# Altium project osuBoard.PrjPcb
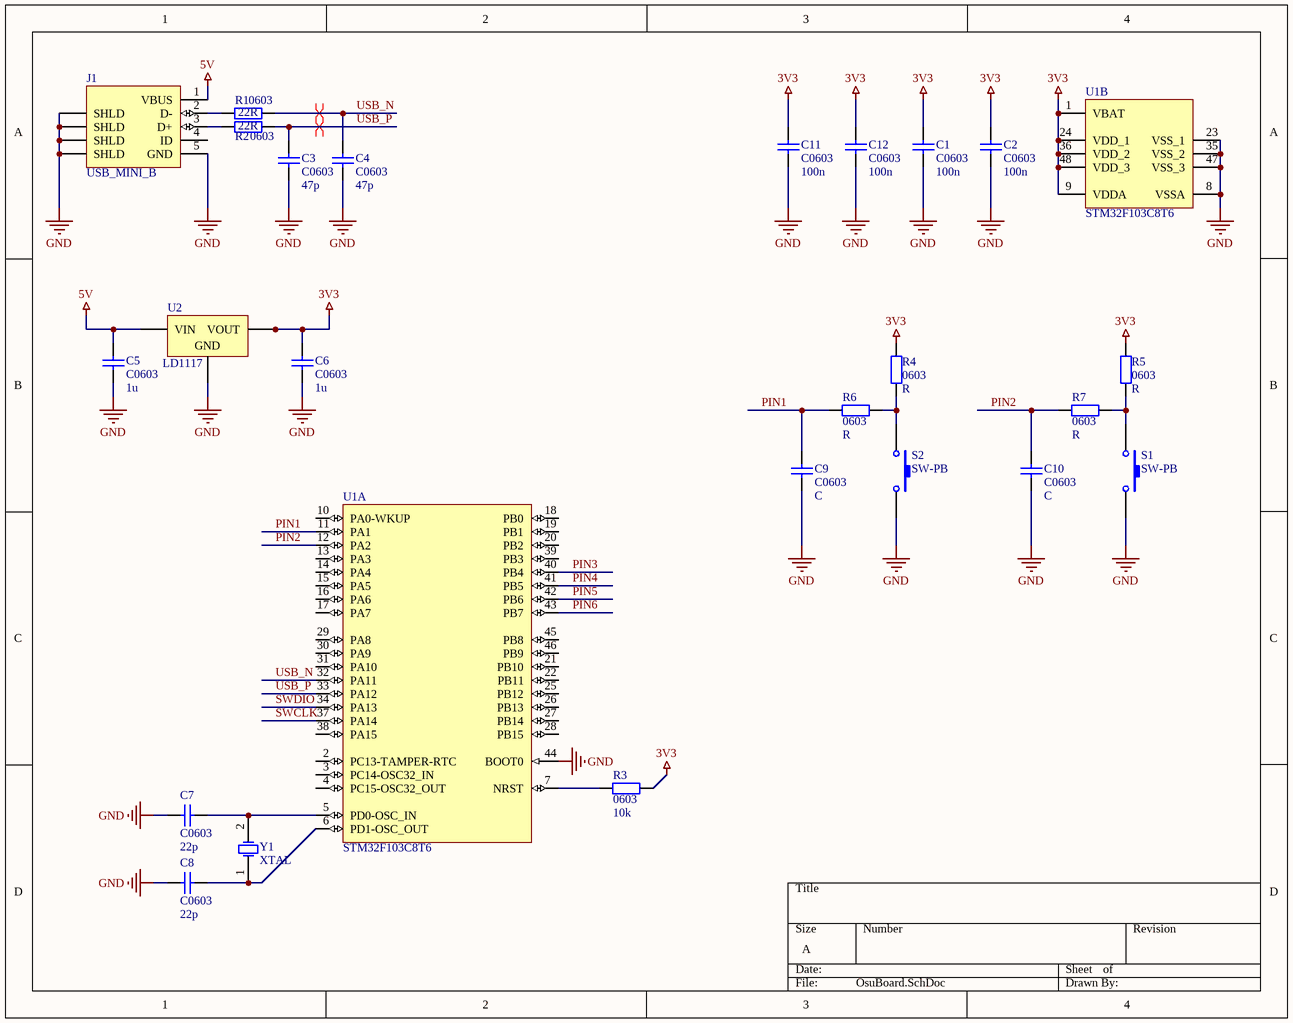
[diagram p0: OsuBoard.SchDoc]
1 sheet, 25 parts. Net scope: global (net labels, ports and power ports of the same name join across sheets).
Board file: OsuBoard.PcbDoc

## Sheet OsuBoard.SchDoc
size A

### Parts
C1  100n  [C0603]
C2  100n  [C0603]
C3  47p  [C0603]
C4  47p  [C0603]
C5  1u  [C0603]
C6  1u  [C0603]
C7  22p  [C0603]
C8  22p  [C0603]
C9  C  [C0603]
C10  C  [C0603]
C11  100n  [C0603]
C12  100n  [C0603]
J1  USB_MINI_B  [USB_Mini_B_9.3x7.7]
R1  22R  [0603]
R2  22R  [0603]
R3  10k  [0603]
R4  R  [0603]
R5  R  [0603]
R6  R  [0603]
R7  R  [0603]
S1  SW-PB  [Cherry MX footprint]
S2  SW-PB  [Cherry MX footprint]
U1  STM32F103C8T6  [QFP_48_0.5_M]  (parts A,B of 2)
U2  LD1117  [TO-252]
Y1  XTAL  [HC49]

### Nets
3V3: C1.1 C2.1 C6.1 C11.1 C12.1 R3.2 R4.1 R5.1 U1.1(VBAT) U1.9(VDDA) U1.24(VDD_1) U1.36(VDD_2) U1.48(VDD_3) U2.2(VOUT) U2.4(VOUT) U2.5(VOUT) U2.6(VOUT)
5V: C5.1 J1.1(VBUS) U2.3(VIN)
GND: C1.2 C2.2 C3.2 C4.2 C5.2 C6.2 C7.1 C8.1 C9.2 C10.2 C11.2 C12.2 J1.5(GND) J1.MH1(SHLD) J1.MH2(SHLD) J1.MH3(SHLD) J1.MH4(SHLD) S1.2 S2.2 U1.8(VSSA) U1.23(VSS_1) U1.35(VSS_2) U1.44(BOOT0) U1.47(VSS_3) U2.1(GND)
PIN1: C9.1 R6.1 U1.11(PA1)
PIN2: C10.1 R7.1 U1.12(PA2)
PIN3: U1.40(PB4)
PIN4: U1.41(PB5)
PIN5: U1.42(PB6)
PIN6: U1.43(PB7)
SWCLK: U1.37(PA14)
SWDIO: U1.34(PA13)
USB_N: C4.1 R1.2 U1.32(PA11)
USB_P: C3.1 R2.2 U1.33(PA12)
NetC7_2: C7.2 U1.5(PD0-OSC_IN) Y1.2(OSC2)
NetC8_2: C8.2 U1.6(PD1-OSC_OUT) Y1.1(OSC1)
NetJ1_2: J1.2(D-) R1.1
NetJ1_3: J1.3(D+) R2.1
NetR3_1: R3.1 U1.7(NRST)
NetR4_2: R4.2 R6.2 S2.1
NetR5_2: R5.2 R7.2 S1.1

Not connected (* = marked no-connect by the designer): J1 4(ID); U1 2(PC13-TAMPER-RTC) 3(PC14-OSC32_IN) 4(PC15-OSC32_OUT) 10(PA0-WKUP) 13(PA3) 14(PA4) 15(PA5) 16(PA6) 17(PA7) 18(PB0) 19(PB1) 20(PB2) 21(PB10) 22(PB11) 25(PB12) 26(PB13) 27(PB14) 28(PB15) 29(PA8) 30(PA9) 31(PA10) 38(PA15) 39(PB3) 45(PB8) 46(PB9)

### Layout directives
differential pair: USB_N, USB_P

### Library data of the parts
C1-C12 = Cap: Generic capacitor; Packge: C0603
  C1 C2 C11 C12: Value: 100n
  C3 C4: Value: 47p
  C5 C6: Value: 1u
  C7 C8: Value: 22p
  C9 C10: Value: C
J1 = USB_MINI_B2: USB On-The-Go (OTG) Mini-B Receptacle
R1-R7 = Res: Generic resistor; Package: 0603
  R1 R2: Value: 22R
  R3: Value: 10k
  R4-R7: Value: R
S1 S2 = SW-PB: Switch; Published: 24-Mar-1999; LatestRevisionDate: 17-Jul-2002; LatestRevisionNote: Re-released for DXP Platform.; PackageReference: SPST-2; Publisher: Altium Limited; PackageDescription: Switch; 2 Leads
U1 = STM32F103C8T6: ARM Cortex-M3 32-bit MCU, 64 KB Flash, 20 KB Internal RAM, 37 I/Os, 48-pin LQFP, -40 to 85 degC, Tray; A/D Converter: 2x12-bit (10 Channel); FLASH Size (Prog) (kB): 64; I/Os (High Current): 37; Internal RAM Size (kB): 20; Operating Frequency(F) (Processor speed) (MHz): 72; Supply Voltage(Vcc) min (V): 2; DatasheetVersion: Rev. 16; PackageVersion: Rev. 6, 06/2013; PackageReference: LQFP48; PackageDescription: 48-Pin Low Profile Quad Flat Package, 7 x 7 mm Body, 0.5 mm Pitch; Supplier 1: Digi-Key; Supplier Part Number 1: 497-6063-ND; Supplier 2: Farnell; Supplier Part Number 2: 1447637; Supplier 3: Newark; Supplier Part Number 3: 59M2182; Supplier 4: Newark; Supplier Part Number 4: 57P1222; Supplier 5: Mouser; Supplier Part Number 5: 511-STM32F103C8T6; Core: ARM Cortex-M3; Packing: Tray; Mounting Technology: Surface Mount; PartNumber: STM32F103C8T6; ComponentLink1Description: Manufacturer URL; ComponentLink1URL: http://www.st.com/web/en/home.html; ComponentLink2Description: Datasheet; ComponentLink2URL: http://www.st.com/st-web-ui/static/active/en/resource/technical/document/datasheet/CD00161566.pdf; ComponentLink3Description: Package Specification; ComponentLink3URL: http://www.st.com/st-web-ui/static/active/en/resource/technical/document/datasheet/DM00058181.pdf
U2 = LD1117: Low drop positive voltage regulator; pin to pad: 2>4 5>4 6>4; ComponentLink1URL: http://www.st.com/web/en/resource/technical/document/datasheet/CD00000544.pdf; ComponentLink1Description: Datasheet
Y1 = XTAL: Crystal Oscillator; Published: 8-Jun-2000; LatestRevisionDate: 17-Jul-2002; LatestRevisionNote: Re-released for DXP Platform.; PackageReference: R38; Publisher: Altium Limited; PackageDescription: Crystal, Thru-Hole; 2 Leads; Body 3.1 x 8.2 mm (Dia.xH)